# Altium schematic sheet 6. Revision History.SchDoc
size A4; SheetNumber: 6; SheetTotal: 6; PageSetup: Record=PageOptions|CenterHorizontal=True|CenterVertical=True|PrintScale=1.00|XCorrection=1.00|YCorrection=1.00|PrintKind=0|BorderSize=5000000|LeftOffset=0|BottomOffset=0|Orientation=2|PaperLength=2970|PaperWidth=2100|Scale=100|PaperSource=7|PrintQuality=300|MediaType=1|DitherType=10|PrintScaleMode=1|PaperKind=A4|PaperIndex=9
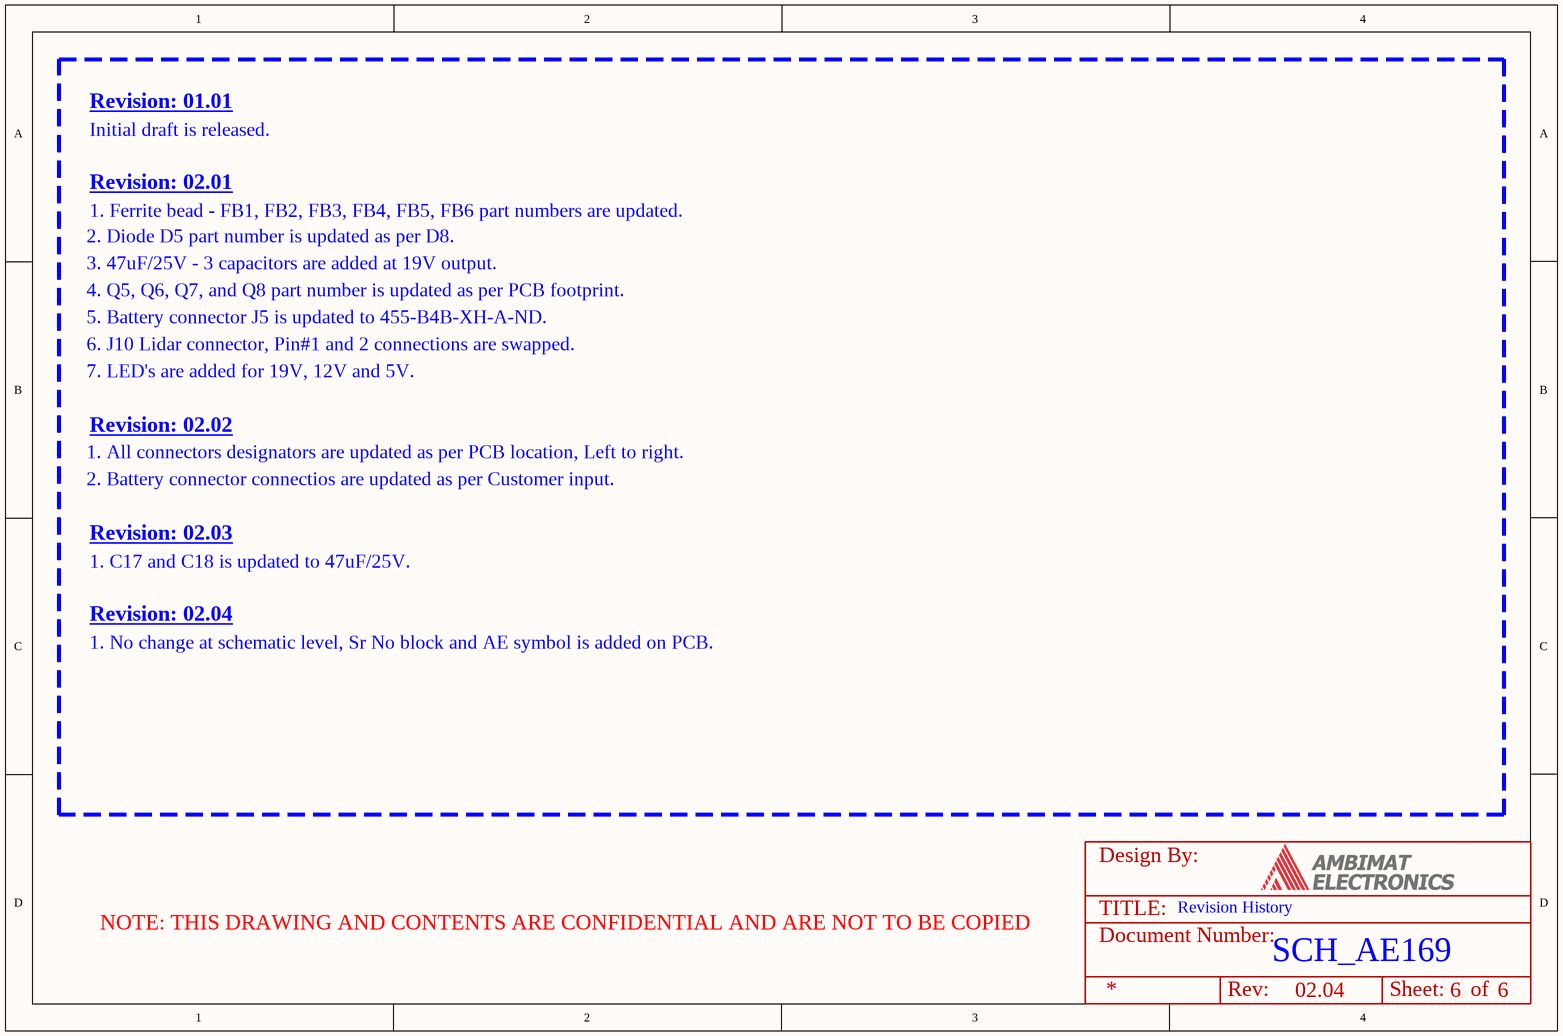
[diagram p0: 6. Revision History.SchDoc]

## Notes on the sheet
- Revision: 01.01
- Initial draft is released.
- 2. Diode D5 part number is updated as per D8.
- Revision: 02.01
- 1. Ferrite bead - FB1, FB2, FB3, FB4, FB5, FB6 part numbers are updated.
- 3. 47uF/25V - 3 capacitors are added at 19V output.
- 4. Q5, Q6, Q7, and Q8 part number is updated as per PCB footprint.
- 5. Battery connector J5 is updated to 455-B4B-XH-A-ND.
- 6. J10 Lidar connector, Pin#1 and 2 connections are swapped.
- 7. LED's are added for 19V, 12V and 5V.
- Revision: 02.02
- 1. All connectors designators are updated as per PCB location, Left to right.
- 2. Battery connector connectios are updated as per Customer input.
- Revision: 02.03
- 1. C17 and C18 is updated to 47uF/25V.
- Revision: 02.04
- 1. No change at schematic level, Sr No block and AE symbol is added on PCB.
- Revision History
- SCH_AE169
- 02.04
- TITLE:
- Design By:
- NOTE: THIS DRAWING AND CONTENTS ARE CONFIDENTIAL AND ARE NOT TO BE COPIED
- Document Number:
- Rev:
- Sheet:
- of